# Altium schematic sheet Analog&Pwr.SchDoc
size 1188 x 840 mm
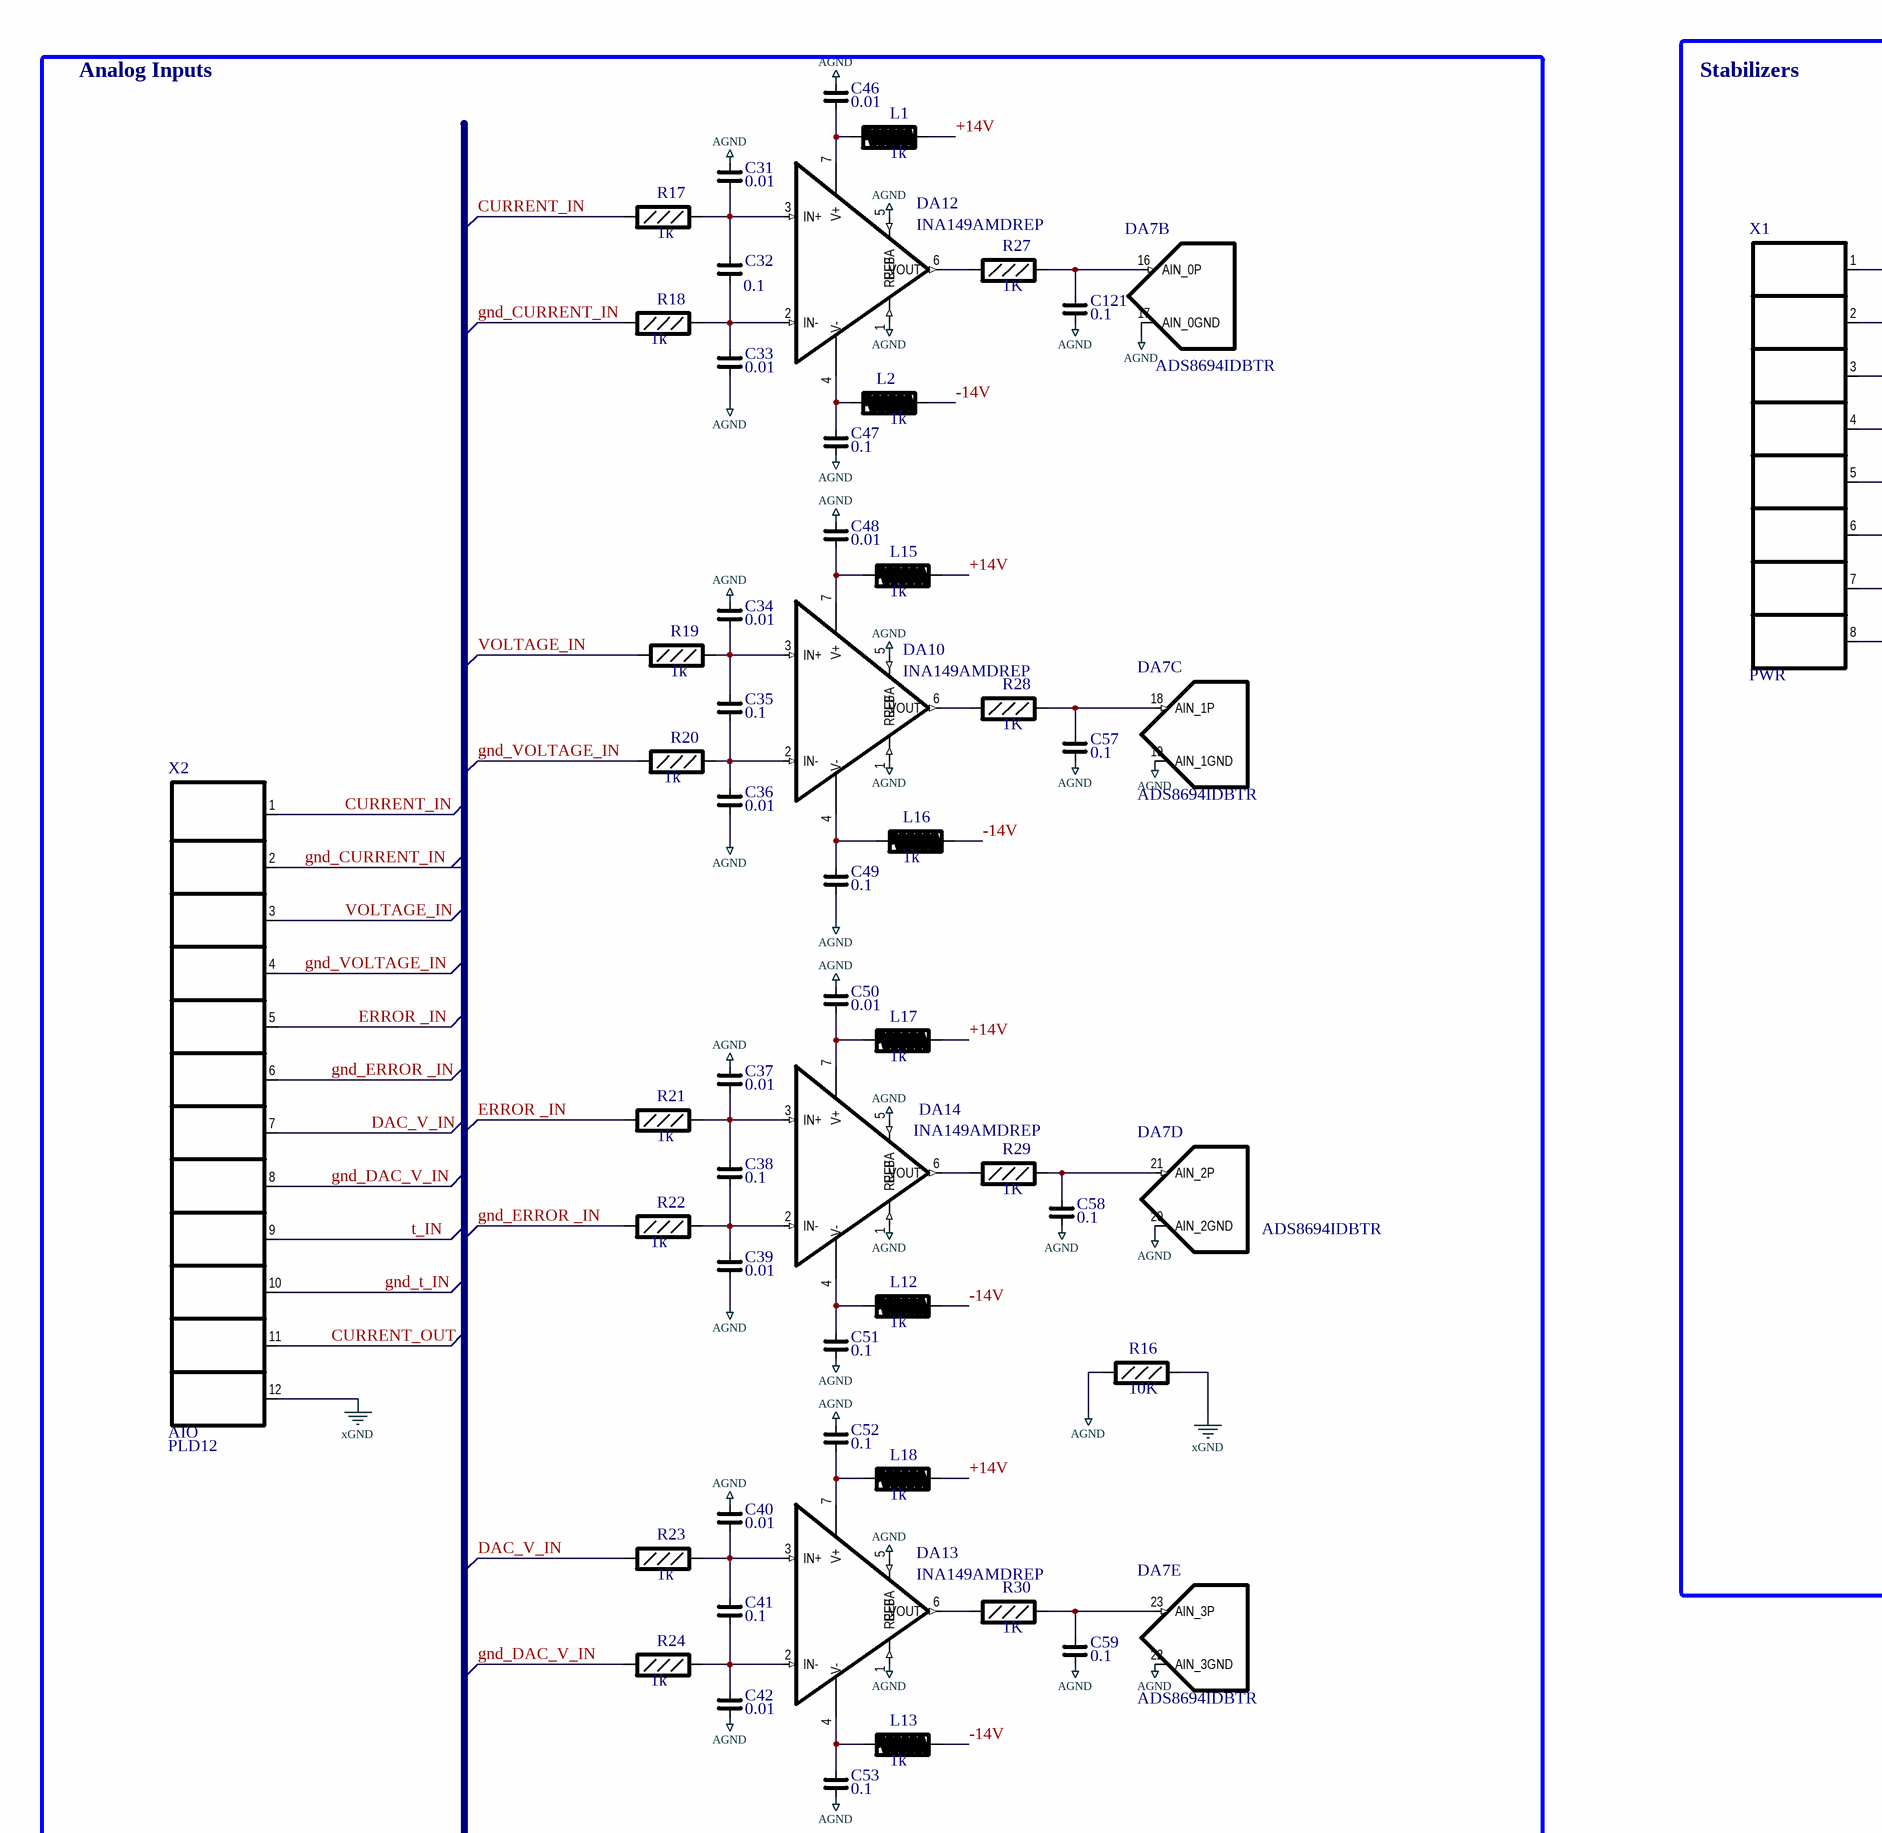
[diagram p0: Analog&Pwr.SchDoc, top left]
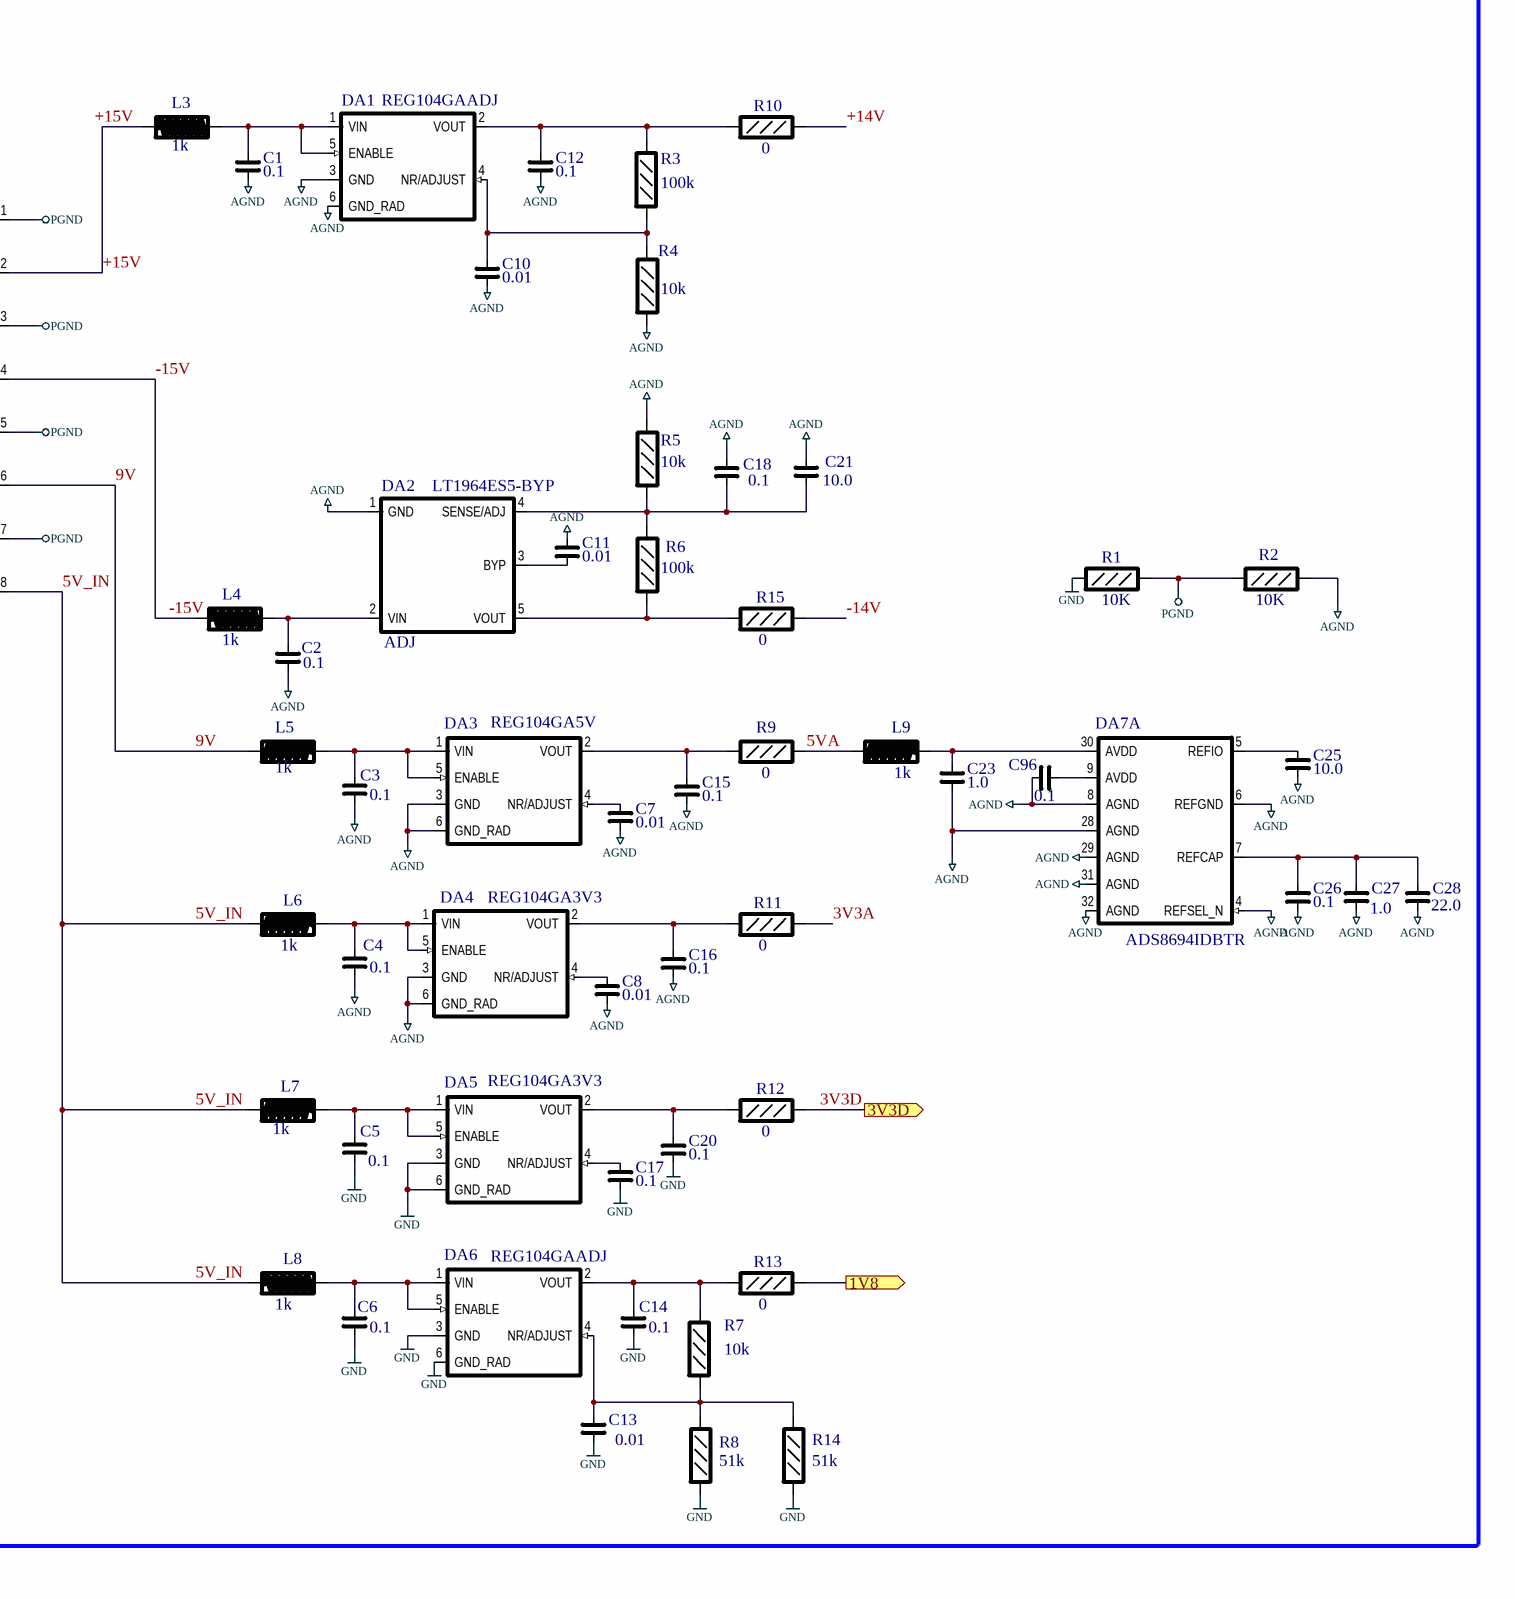
[diagram p1: Analog&Pwr.SchDoc, top right]
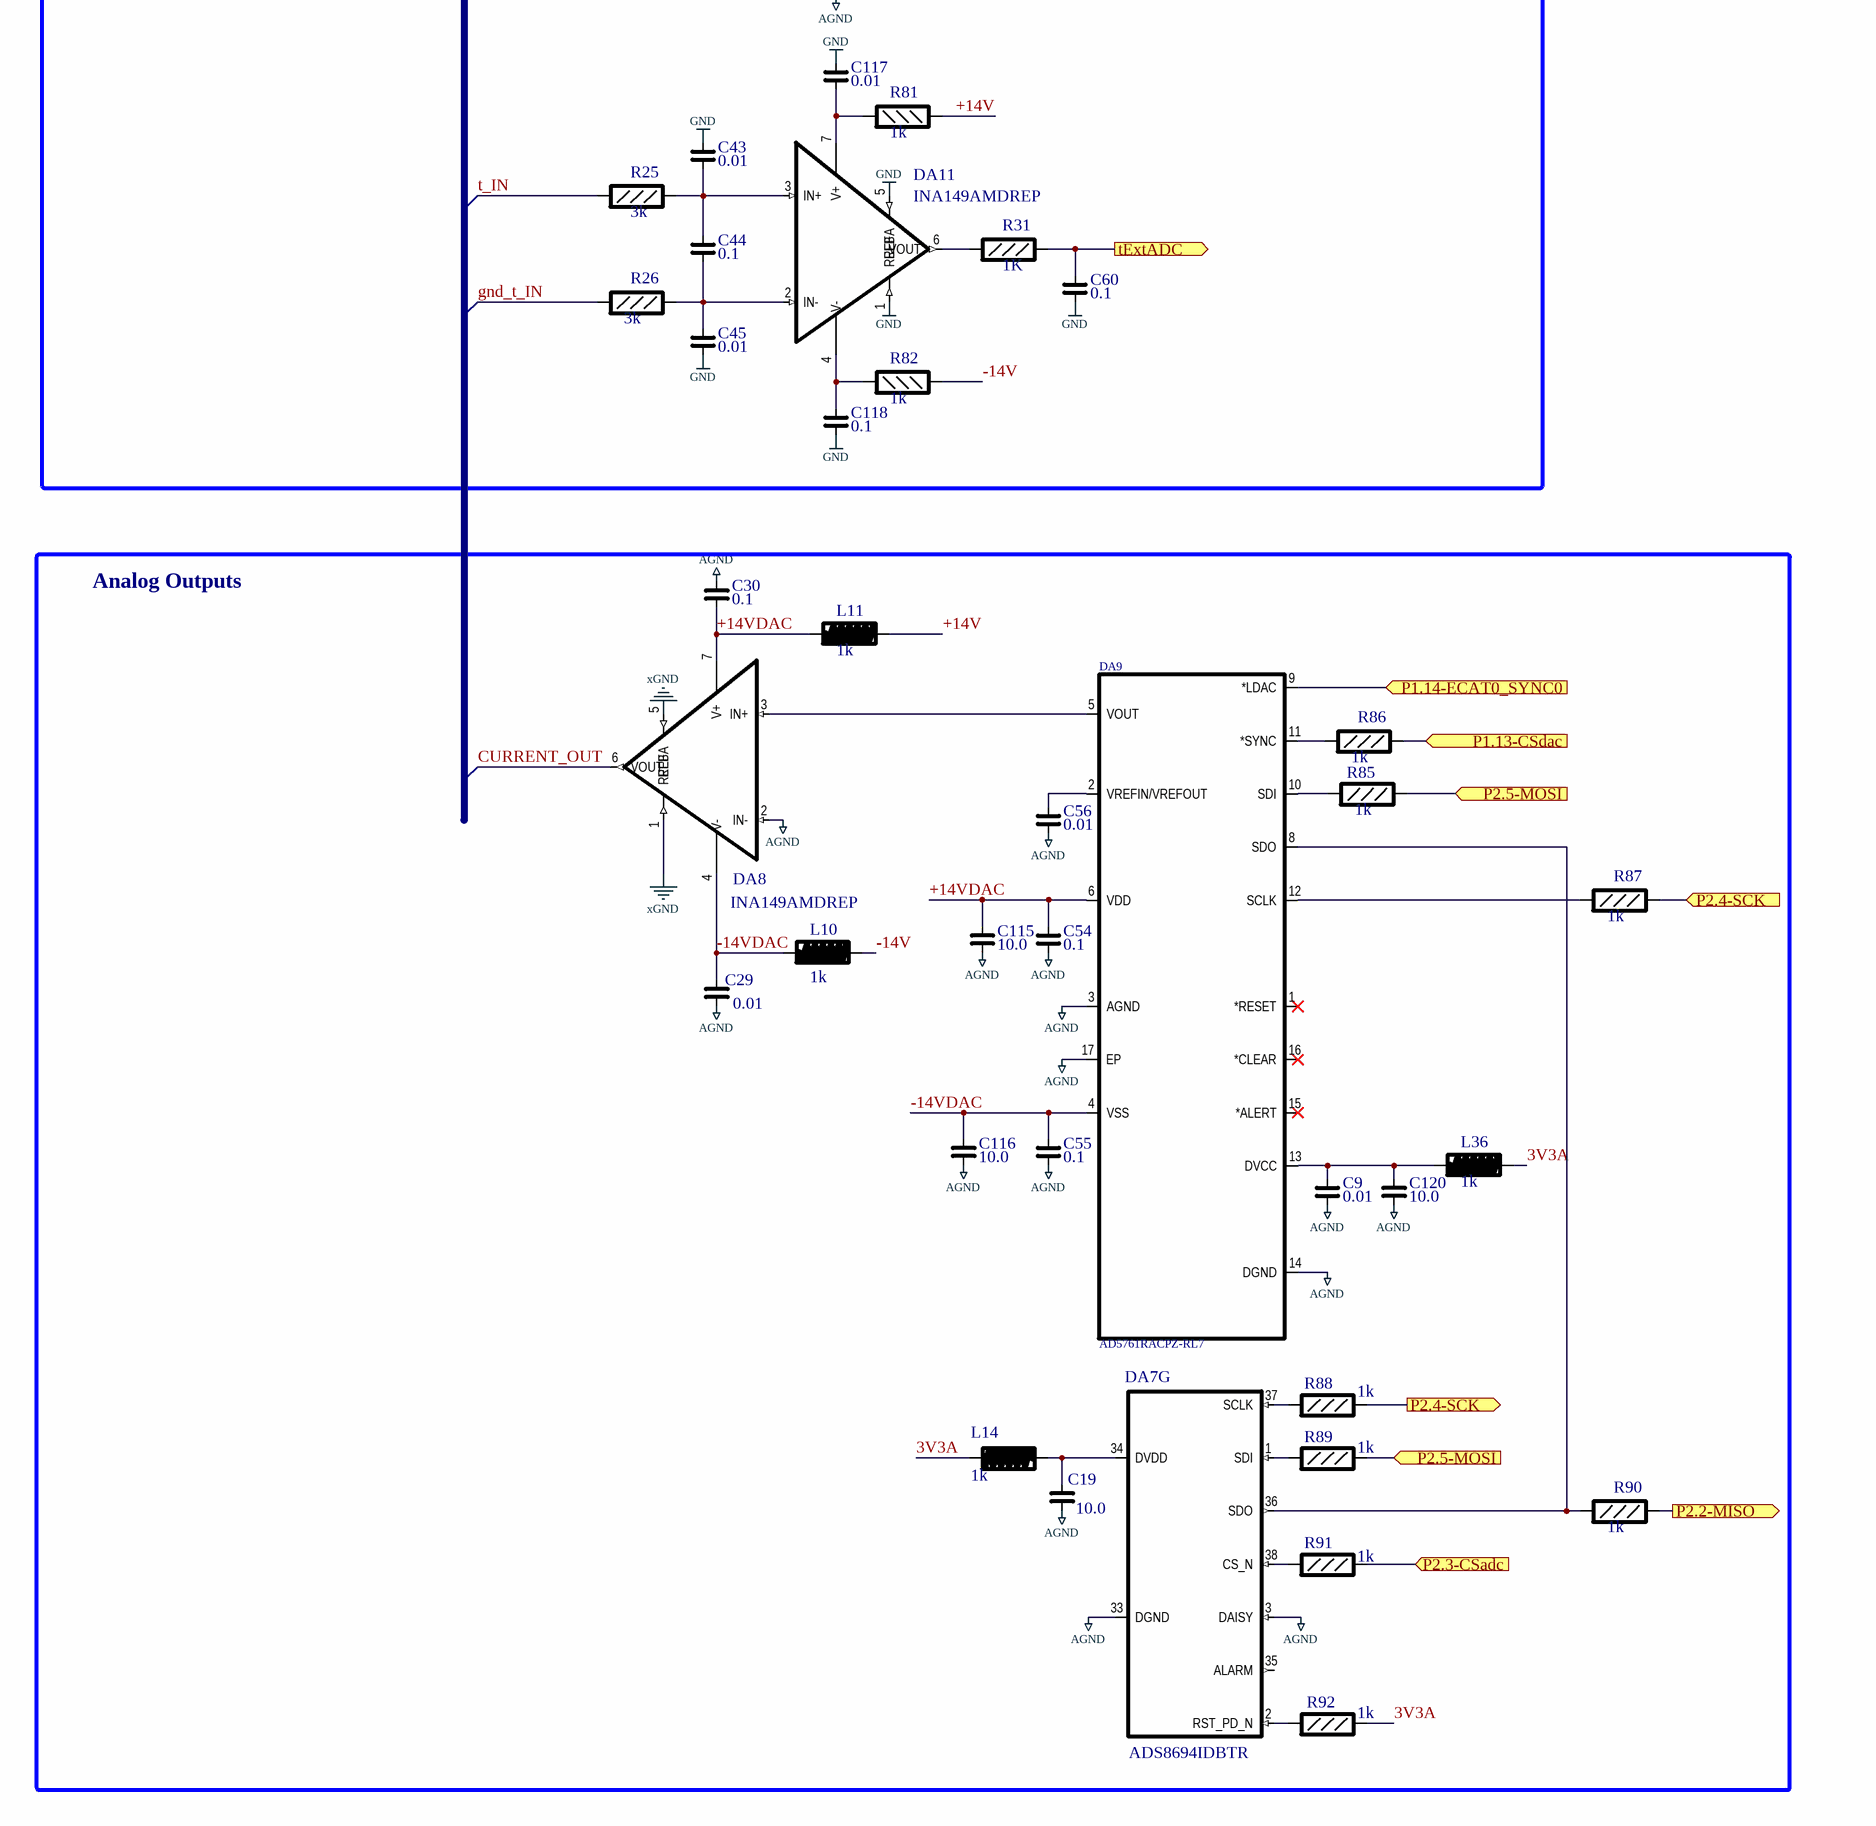
[diagram p2: Analog&Pwr.SchDoc, bottom left]
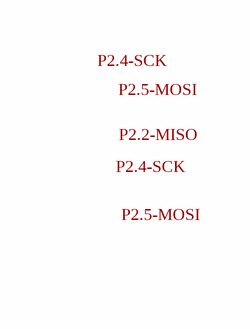
[diagram p3: Analog&Pwr.SchDoc, bottom right]

## Parts
C1  0.1  [CAPC1608X85N]
C2  0.1  [CAPC1608X85N]
C3  0.1  [CAPC1608X85N]
C4  0.1  [CAPC1608X85N]
C5  0.1  [CAPC1608X85N]
C6  0.1  [CAPC1608X85N]
C7  0.01  [CAPC1608X85N]
C8  0.01  [CAPC1608X85N]
C9  0.01  [CAPC1608X85N]
C10  0.01  [CAPC1608X85N]
C11  0.01  [CAPC1608X85N]
C12  0.1  [CAPC1608X85N]
C13  0.01  [CAPC1608X85N]
C14  0.1  [CAPC1608X85N]
C15  0.1  [CAPC1608X85N]
C16  0.1  [CAPC1608X85N]
C17  0.1  [CAPC1608X85N]
C18  0.1  [CAPC1608X85N]
C19  10.0  [CAPC2012X135N]
C20  0.1  [CAPC1608X85N]
C21  10.0  [CAPC2012X135N]
C23  1.0  [CAPC2012X135N]
C25  10.0  [CAPC2012X135N]
C26  0.1  [CAPC1608X85N]
C27  1.0  [CAPC2012X135N]
C28  22.0  [CAPC2012X135N]
C29  0.01  [CAPC1608X85N]
C30  0.1  [CAPC1608X85N]
C31  0.01  [CAPC1608X85N]
C32  0.1  [CAPC1608X85N]
C33  0.01  [CAPC1608X85N]
C34  0.01  [CAPC1608X85N]
C35  0.1  [CAPC1608X85N]
C36  0.01  [CAPC1608X85N]
C37  0.01  [CAPC1608X85N]
C38  0.1  [CAPC1608X85N]
C39  0.01  [CAPC1608X85N]
C40  0.01  [CAPC1608X85N]
C41  0.1  [CAPC1608X85N]
C42  0.01  [CAPC1608X85N]
C43  0.01  [CAPC1608X85N]
C44  0.1  [CAPC1608X85N]
C45  0.01  [CAPC1608X85N]
C46  0.01  [CAPC1608X85N]
C47  0.1  [CAPC1608X85N]
C48  0.01  [CAPC1608X85N]
C49  0.1  [CAPC1608X85N]
C50  0.01  [CAPC1608X85N]
C51  0.1  [CAPC1608X85N]
C52  0.1  [CAPC1608X85N]
C53  0.1  [CAPC1608X85N]
C54  0.1  [CAPC1608X85N]
C55  0.1  [CAPC1608X85N]
C56  0.01  [CAPC1608X85N]
C57  0.1  [CAPC1608X85N]
C58  0.1  [CAPC1608X85N]
C59  0.1  [CAPC1608X85N]
C60  0.1  [CAPC1608X85N]
C96  0.1  [CAPC1608X85N]
C115  10.0  [CAPC2012X135N]
C116  10.0  [CAPC2012X135N]
C117  0.01  [CAPC1608X85N]
C118  0.1  [CAPC1608X85N]
C120  10.0  [CAPC2012X135N]
C121  0.1  [CAPC1608X85N]
DA1  REG104GAADJ  [SOT223_6-127]
DA2  LT1964ES5-BYP  value ADJ  [SOT23_5-0.95AD-M]
DA3  REG104GA5V  [SOT223_6-127]
DA4  REG104GA3V3  [SOT223_6-127]
DA5  REG104GA3V3  [SOT223_6-127]
DA6  REG104GAADJ  [SOT223_6-127]
DA7  ADS8694IDBTR  [TSSOP_38-50]  (parts A,B,C,D,E,G of 7)
DA8  INA149AMDREP  [SOIC8]
DA9  AD5761RACPZ-RL7  [CP_16_22_ADI-M]
DA10  INA149AMDREP  [SOIC8]
DA11  INA149AMDREP  [SOIC8]
DA12  INA149AMDREP  [SOIC8]
DA13  INA149AMDREP  [SOIC8]
DA14  INA149AMDREP  [SOIC8]
L1  1k  [RESC2012X50N]
L2  1k  [RESC2012X50N]
L3  1k  [RESC2012X50N]
L4  1k  [RESC2012X50N]
L5  1k  [RESC2012X50N]
L6  1k  [RESC2012X50N]
L7  1k  [RESC2012X50N]
L8  1k  [RESC2012X50N]
L9  1k  [RESC2012X50N]
L10  1k  [RESC2012X50N]
L11  1k  [RESC2012X50N]
L12  1k  [RESC2012X50N]
L13  1k  [RESC2012X50N]
L14  1k  [RESC2012X50N]
L15  1k  [RESC2012X50N]
L16  1k  [RESC2012X50N]
L17  1k  [RESC2012X50N]
L18  1k  [RESC2012X50N]
L36  1k  [RESC2012X50N]
R1  10K  [RESC1608X50N]
R2  10K  [RESC1608X50N]
R3  100k  [RESC1608X50N]
R4  10k  [RESC1608X50N]
R5  10k  [RESC1608X50N]
R6  100k  [RESC1608X50N]
R7  10k  [RESC1608X50N]
R8  51k  [RESC1608X50N]
R9  0  [RESC1608X50N]
R10  0  [RESC1608X50N]
R11  0  [RESC1608X50N]
R12  0  [RESC1608X50N]
R13  0  [RESC1608X50N]
R14  51k  [RESC1608X50N]
R15  0  [RESC1608X50N]
R16  10K  [RESC1608X50N]
R17  1k  [RESC1608X50N]
R18  1k  [RESC1608X50N]
R19  1k  [RESC1608X50N]
R20  1k  [RESC1608X50N]
R21  1k  [RESC1608X50N]
R22  1k  [RESC1608X50N]
R23  1k  [RESC1608X50N]
R24  1k  [RESC1608X50N]
R25  3k  [RESC1608X50N]
R26  3k  [RESC1608X50N]
R27  1K  [RESC1608X50N]
R28  1K  [RESC1608X50N]
R29  1K  [RESC1608X50N]
R30  1K  [RESC1608X50N]
R31  1K  [RESC1608X50N]
R81  1k  [RESC1608X50N]
R82  1k  [RESC1608X50N]
R85  1k  [RESC1608X50N]
R86  1k  [RESC1608X50N]
R87  1k  [RESC1608X50N]
R88  1k  [RESC1608X50N]
R89  1k  [RESC1608X50N]
R90  1k  [RESC1608X50N]
R91  1k  [RESC1608X50N]
R92  1k  [RESC1608X50N]
X1  PWR  [DIP_8-254_WO_CASE]
X2  AIO  [DIP_12-254_WO_CASE]

## Blocks framed on the sheet
Analog Inputs: C31-C53 C57-C60 C117 C118 C121 DA7 DA10-DA14 L1 L2 L12 L13 L15-L18 R16-R31 R81 R82 X2
Stabilizers: C1-C8 C10-C18 C20 C21 C23 C25-C28 C96 DA1-DA7 L3-L9 R1-R15 X1
Analog Outputs: C9 C19 C29 C30 C54-C56 C115 C116 C120 DA7-DA9 L10 L11 L14 L36 R85-R92

## Ports
1V8 (out), 3V3D (out), P1.13-CSdac (in), P1.14-ECAT0_SYNC0 (in), P2.2-MISO (out), P2.3-CSadc (in), P2.4-SCK (in), P2.4-SCK (out), P2.5-MOSI (in), tExtADC (out)

## Nets
AGND: C1.1 C2.1 C3.1 C4.1 C7.1 C8.1 C9.1 C10.1 C11.1 C12.1 C15.1 C16.1 C18.1 C19.1 C21.2 C23.1 C25.1 C26.2 C27.1 C28.1 C29.2 C30.1 C31.2 C33.1 C34.2 C36.1 C37.2 C39.1 C40.2 C42.1 C46.2 C47.1 C48.2 C49.1 C50.2 C51.1 C52.2 C53.1 C54.1 C55.1 C56.1 C57.1 C58.1 C59.1 C96.2 C115.1 C116.1 C120.1 C121.1 DA1.3(GND) DA1.6(GND_RAD) DA2.1(GND) DA3.3(GND) DA3.6(GND_RAD) DA4.3(GND) DA4.6(GND_RAD) DA7.3(DAISY) DA7.4(REFSEL_N) DA7.6(REFGND) DA7.8(AGND) DA7.17(AIN_0GND) DA7.19(AIN_1GND) DA7.20(AIN_2GND) DA7.22(AIN_3GND) DA7.28(AGND) DA7.29(AGND) DA7.31(AGND) DA7.32(AGND) DA7.33(DGND) DA8.2(IN-) DA9.3(AGND) DA9.14(DGND) DA9.17(EP) DA10.1(REFB) DA10.5(REFA) DA12.1(REFB) DA12.5(REFA) DA13.1(REFB) DA13.5(REFA) DA14.1(REFB) DA14.5(REFA) R2.2 R4.1 R5.2 R16.1
GND: C5.1 C6.1 C13.1 C14.1 C17.1 C20.1 C43.2 C45.1 C60.1 C117.2 C118.1 DA5.3(GND) DA5.6(GND_RAD) DA6.3(GND) DA6.6(GND_RAD) DA11.1(REFB) DA11.5(REFA) R1.1 R8.1 R14.1
PGND: R1.2 R2.1 X1.1 X1.3 X1.5 X1.7
xGND: DA8.1(REFB) DA8.5(REFA) R16.2 X2.12
1V8: R13.2 ; port 1V8
3V3A: L14.1 L36.1 R11.2 R92.2
3V3D: R12.2 ; port 3V3D
5V_IN: L6.1 L7.1 L8.2 X1.8
5VA: L9.1 R9.2
9V: L5.1 X1.6
+14V: L1.1 L11.1 L15.1 L17.1 L18.1 R10.2 R81.1
+14VDAC: C30.2 C54.2 C115.2 DA8.7(V+) DA9.6(VDD) L11.2
+15V: L3.2 X1.2
-14V: L2.1 L10.1 L12.1 L13.1 L16.1 R15.2 R82.1
-14VDAC: C29.1 C55.2 C116.2 DA8.4(V-) DA9.4(VSS) L10.2
-15V: L4.2 X1.4
CURRENT_IN: R17.1 X2.1
CURRENT_OUT: DA8.6(VOUT) X2.11
DAC_V_IN: R23.1 X2.7
ERROR _IN: R21.1 X2.5
gnd_CURRENT_IN: R18.1 X2.2
gnd_DAC_V_IN: R24.1 X2.8
gnd_ERROR _IN: R22.1 X2.6
gnd_t_IN: R26.1 X2.10
gnd_VOLTAGE_IN: R20.1 X2.4
P1.13-CSdac: R86.2 ; port P1.13-CSdac
P1.14-ECAT0_SYNC0: DA9.9(*LDAC) ; port P1.14-ECAT0_SYNC0
P2.2-MISO: R90.2 ; port P2.2-MISO
P2.3-CSadc: R91.2 ; port P2.3-CSadc
P2.4-SCK: R87.2 R88.2 ; port P2.4-SCK
P2.5-MOSI: R85.2 R89.2 ; port P2.5-MOSI
t_IN: R25.1 X2.9
tExtADC: C60.2 R31.2 ; port tExtADC
VOLTAGE_IN: R19.1 X2.3
NetC1_2: C1.2 DA1.1(VIN) DA1.5(ENABLE) L3.1
NetC2_2: C2.2 DA2.2(VIN) L4.1
NetC3_2: C3.2 DA3.1(VIN) DA3.5(ENABLE) L5.2
NetC4_2: C4.2 DA4.1(VIN) DA4.5(ENABLE) L6.2
NetC5_2: C5.2 DA5.1(VIN) DA5.5(ENABLE) L7.2
NetC6_2: C6.2 DA6.1(VIN) DA6.5(ENABLE) L8.1
NetC7_2: C7.2 DA3.4(NR/ADJUST)
NetC8_2: C8.2 DA4.4(NR/ADJUST)
NetC9_2: C9.2 C120.2 DA9.13(DVCC) L36.2
NetC10_2: C10.2 DA1.4(NR/ADJUST) R3.2 R4.2
NetC11_2: C11.2 DA2.3(BYP)
NetC12_2: C12.2 DA1.2(VOUT) R3.1 R10.1
NetC13_2: C13.2 DA6.4(NR/ADJUST) R7.2 R8.2 R14.2
NetC14_2: C14.2 DA6.2(VOUT) R7.1 R13.1
NetC15_2: C15.2 DA3.2(VOUT) R9.1
NetC16_2: C16.2 DA4.2(VOUT) R11.1
NetC17_2: C17.2 DA5.4(NR/ADJUST)
NetC18_2: C18.2 C21.1 DA2.4(SENSE/ADJ) R5.1 R6.2
NetC19_2: C19.2 DA7.34(DVDD) L14.2
NetC20_2: C20.2 DA5.2(VOUT) R12.1
NetC23_2: C23.2 DA7.30(AVDD) L9.2
NetC25_2: C25.2 DA7.5(REFIO)
NetC26_1: C26.1 C27.2 C28.2 DA7.7(REFCAP)
NetC31_1: C31.1 C32.2 DA12.3(IN+) R17.2
NetC32_1: C32.1 C33.2 DA12.2(IN-) R18.2
NetC34_1: C34.1 C35.2 DA10.3(IN+) R19.2
NetC35_1: C35.1 C36.2 DA10.2(IN-) R20.2
NetC37_1: C37.1 C38.2 DA14.3(IN+) R21.2
NetC38_1: C38.1 C39.2 DA14.2(IN-) R22.2
NetC40_1: C40.1 C41.2 DA13.3(IN+) R23.2
NetC41_1: C41.1 C42.2 DA13.2(IN-) R24.2
NetC43_1: C43.1 C44.2 DA11.3(IN+) R25.2
NetC44_1: C44.1 C45.2 DA11.2(IN-) R26.2
NetC46_1: C46.1 DA12.7(V+) L1.2
NetC47_2: C47.2 DA12.4(V-) L2.2
NetC48_1: C48.1 DA10.7(V+) L15.2
NetC49_2: C49.2 DA10.4(V-) L16.2
NetC50_1: C50.1 DA14.7(V+) L17.2
NetC51_2: C51.2 DA14.4(V-) L12.2
NetC52_1: C52.1 DA13.7(V+) L18.2
NetC53_2: C53.2 DA13.4(V-) L13.2
NetC56_2: C56.2 DA9.2(VREFIN/VREFOUT)
NetC57_2: C57.2 DA7.18(AIN_1P) R28.2
NetC58_2: C58.2 DA7.21(AIN_2P) R29.2
NetC59_2: C59.2 DA7.23(AIN_3P) R30.2
NetC96_1: C96.1 DA7.9(AVDD)
NetC117_1: C117.1 DA11.7(V+) R81.2
NetC118_2: C118.2 DA11.4(V-) R82.2
NetC121_2: C121.2 DA7.16(AIN_0P) R27.2
NetDA2_5: DA2.5(VOUT) R6.1 R15.1
NetDA7_1: DA7.1(SDI) R89.1
NetDA7_2: DA7.2(RST_PD_N) R92.1
NetDA7_36: DA7.36(SDO) DA9.8(SDO) R90.1
NetDA7_37: DA7.37(SCLK) R88.1
NetDA7_38: DA7.38(CS_N) R91.1
NetDA8_3: DA8.3(IN+) DA9.5(VOUT)
NetDA9_10: DA9.10(SDI) R85.1
NetDA9_11: DA9.11(*SYNC) R86.1
NetDA9_12: DA9.12(SCLK) R87.1
NetDA10_6: DA10.6(VOUT) R28.1
NetDA11_6: DA11.6(VOUT) R31.1
NetDA12_6: DA12.6(VOUT) R27.1
NetDA13_6: DA13.6(VOUT) R30.1
NetDA14_6: DA14.6(VOUT) R29.1

Not connected (* = marked no-connect by the designer): DA7 12(NC) 13(NC) 14(NC) 15(NC) 24(NC) 25(NC) 26(NC) 27(NC) 35(ALARM); DA8 8(NC); DA9 1(*RESET)* 7(DNC) 15(*ALERT)* 16(*CLEAR)*; DA10 8(NC); DA11 8(NC); DA12 8(NC); DA13 8(NC); DA14 8(NC)

## Notes on the sheet
- Labels drawn without touching a wire or pin: +15V, P2.2-MISO, P2.4-SCK, P2.5-MOSI
- Перв. примен.
- Справ. №
- Подп. и дата
- Инв. № дубл.
- Взам. инв. №
- Разраб.
- Изм.
- Лист
- № докум.
- Подп.
- Дата
- Лит.
- Масса
- Масштаб
- Пров.
- Т.контр.
- Листов
- Инв. № подл.
- Утв.
- Н.контр.
- Копировал
- Формат А0

## Library data of the parts
C1-C16 C18 C26 C29-C60 C96 C117 C118 C121 = CAP00603: Chip capasitor 0603; Group: Passive; Vendor: Vishay; Unit Price: 0.1; Descr: Chip capasitor 0603; Package: 0603
  C1-C6 C12 C14-C16 C18 C26 C30 C32 C35 C38 C41 C44 C47 C49 C51-C55 C57-C60 C96 C118 C121: Value: 0.1
  C7-C11 C13 C29 C31 C33 C34 C36 C37 C39 C40 C42 C43 C45 C46 C48 C50 C56 C117: Value: 0.01
C17 C20 = CAP00603: Chip capasitor 0603; Group: Passive; Vendor: Vishay; Value: 0.01; Unit Price: 0.1; Descr: Chip capasitor 0603; Package: 0603
C19 C21 C23 C25 C27 C28 C115 C116 C120 = CAP0805: Chip capasitor 0805; Group: Passive; Vendor: Vishay; Unit Price: 0.1; Descr: Chip capasitor 0805; Package: SMD0805
  C19 C21 C25 C115 C116 C120: Value: 10.0
  C23 C27: Value: 1.0
  C28: Value: 22.0
DA1 DA6 = REG104GA: Positive LDO Linear stabilizer; Vendor: Texas Instruments; Value: ADJ; Device: REG104GA; Unit Price: 6; Package: SOT223-6
DA2 = LT1964: Negative LDO Linear stabilizer; Vendor: Analog Devices Inc; Device: LT1964ES5-BYP; Type: DEV; Package: SOT23_5; Unit Price: 4
DA3 = REG104GA: Positive LDO Linear stabilizer; Vendor: Texas Instruments; Value: 5V; Device: REG104GA; Unit Price: 6; Package: SOT223-6
DA4 DA5 = REG104GA: Positive LDO Linear stabilizer; Vendor: Texas Instruments; Value: 3V3; Device: REG104GA; Unit Price: 6; Package: SOT223-6
DA7 = ADS8694IDBT: 18bit 4ch SAR ADC; Vendor: Texas Instruments; Unit_Price: 10; Application_BuildNumber: *; Device: ADS8694IDBTR; Package: TSSOP38-05
DA8 DA10-DA14 = INA149AMDREP: High CM Voltage instrumental amplifier; Vendor: Texas Instruments; Device: INA149AMDREP; Unit Price: 8; Package: SOIC8
DA9 = AD5761RACPZ-RL7: 16bit DAC; Vendor: Analog Devices Inc; Unit_Price: 15; Device: AD5761RACPZ-RL7; Package: LFCSP16-0,5
L1-L18 L36 = BLM21: SMD Ferrite beadr 0805; Vendor: Vishay; Unit Price: 0.1; Package: SMD0805; Value: 1k; Device: BLM21
R1-R31 R81 R82 R85-R92 = Res0603: Chip resistor 0603; Group: Passive; Vendor: Vishay; Unit Price: 0.005; Descr: Chip resistor 0603; Package: SMD0603
  R1 R2 R16: Value: 10K
  R3 R6: Value: 100k
  R4 R5 R7: Value: 10k
  R8 R14: Value: 51k
  R9-R13 R15: Value: 0
  R17-R24 R81 R82 R85-R92: Value: 1k
  R25 R26: Value: 3k
  R27-R31: Value: 1K
X1 = PLD8: 8 pin TRH connector 2.54mm pitch; Vendor: Connfly; Pckage: DIP8- 2.54; Unit Price: 0.2; Value: PWR; Device: PLD8
X2 = PLD12: 12 pin TRH connector 2.54mm pitch; Vendor: Connfly; Pckage: DIP12- 2.54; Unit Price: 0.2; Value: AIO; Device: PLD12